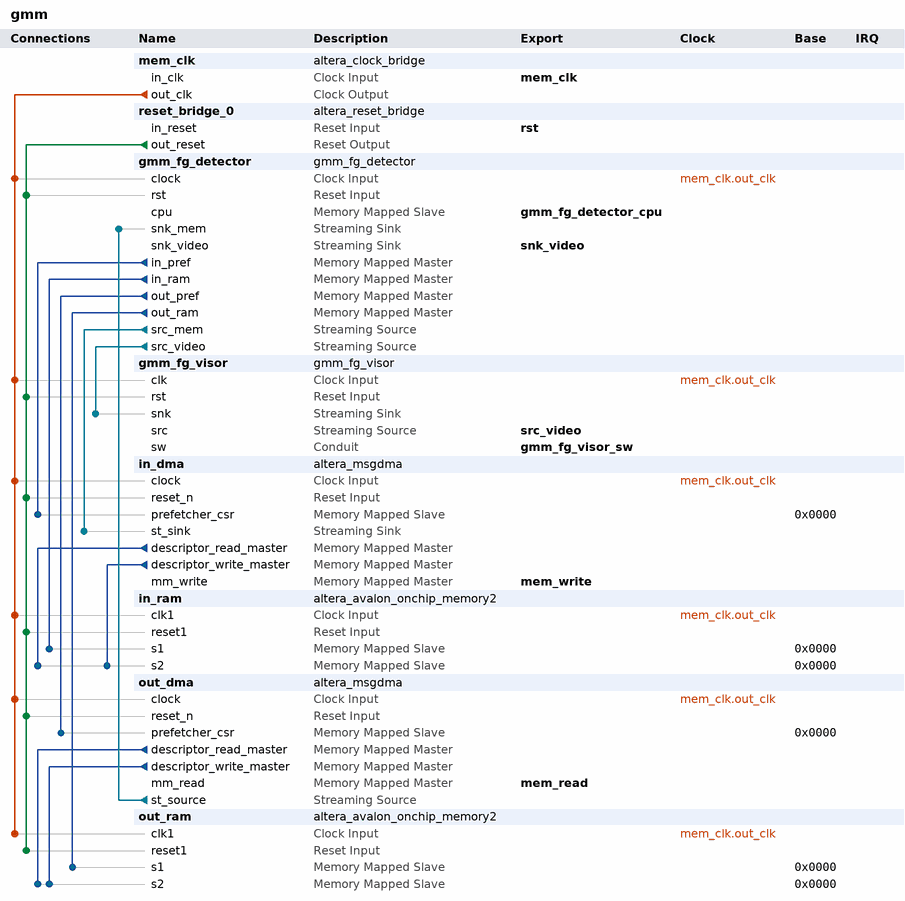
[diagram p0: system contents]
# Platform Designer (Qsys) system gmm, Cyclone V 5CSEBA6U23I7
# Parameters at their usual value, and those the tool derives, are not listed.
package require -exact qsys 18.1
create_system gmm
set_project_property DEVICE_FAMILY {Cyclone V}
set_project_property DEVICE 5CSEBA6U23I7

add_instance mem_clk altera_clock_bridge 18.1
set_instance_parameter_value mem_clk DERIVED_CLOCK_RATE 0
set_instance_parameter_value mem_clk EXPLICIT_CLOCK_RATE 0

add_instance reset_bridge_0 altera_reset_bridge 18.1
set_instance_parameter_value reset_bridge_0 ACTIVE_LOW_RESET 0
set_instance_parameter_value reset_bridge_0 SYNCHRONOUS_EDGES none

add_instance gmm_fg_detector gmm_fg_detector 1.13
set_instance_parameter_value gmm_fg_detector CONTROL_SPAN_BYTES 32
set_instance_parameter_value gmm_fg_detector FRAMES_NUM 2
set_instance_parameter_value gmm_fg_detector VIDEO_SPAN_BYTES 33177616
set_instance_parameter_value gmm_fg_detector VIDEO_START_ADDR 0

add_instance gmm_fg_visor gmm_fg_visor 1.0

add_instance in_dma altera_msgdma 18.1
set_instance_parameter_value in_dma BURST_ENABLE 1
set_instance_parameter_value in_dma DATA_FIFO_DEPTH 256
set_instance_parameter_value in_dma DATA_WIDTH 128
set_instance_parameter_value in_dma DESCRIPTOR_FIFO_DEPTH 16
set_instance_parameter_value in_dma ENHANCED_FEATURES 0
set_instance_parameter_value in_dma ERROR_ENABLE 0
set_instance_parameter_value in_dma MAX_BURST_COUNT 64
set_instance_parameter_value in_dma MAX_BYTE 1073741824
set_instance_parameter_value in_dma MODE 2
set_instance_parameter_value in_dma PACKET_ENABLE 1
set_instance_parameter_value in_dma PREFETCHER_ENABLE 1
set_instance_parameter_value in_dma TRANSFER_TYPE {Full Word Accesses Only}

add_instance in_ram altera_avalon_onchip_memory2 18.1
set_instance_parameter_value in_ram dataWidth 256
set_instance_parameter_value in_ram dualPort true
set_instance_parameter_value in_ram initMemContent false
set_instance_parameter_value in_ram initializationFileName onchip_mem.hex
set_instance_parameter_value in_ram memorySize 2048
set_instance_parameter_value in_ram singleClockOperation true

add_instance out_dma altera_msgdma 18.1
set_instance_parameter_value out_dma BURST_ENABLE 1
set_instance_parameter_value out_dma DATA_FIFO_DEPTH 256
set_instance_parameter_value out_dma DATA_WIDTH 128
set_instance_parameter_value out_dma DESCRIPTOR_FIFO_DEPTH 16
set_instance_parameter_value out_dma ENHANCED_FEATURES 0
set_instance_parameter_value out_dma ERROR_ENABLE 0
set_instance_parameter_value out_dma MAX_BURST_COUNT 64
set_instance_parameter_value out_dma MAX_BYTE 1073741824
set_instance_parameter_value out_dma MODE 1
set_instance_parameter_value out_dma PACKET_ENABLE 1
set_instance_parameter_value out_dma PREFETCHER_ENABLE 1
set_instance_parameter_value out_dma TRANSFER_TYPE {Full Word Accesses Only}

add_instance out_ram altera_avalon_onchip_memory2 18.1
set_instance_parameter_value out_ram dataWidth 256
set_instance_parameter_value out_ram dualPort true
set_instance_parameter_value out_ram initMemContent false
set_instance_parameter_value out_ram initializationFileName onchip_mem.hex
set_instance_parameter_value out_ram memorySize 2048
set_instance_parameter_value out_ram singleClockOperation true

# connections
add_connection mem_clk.out_clk gmm_fg_detector.clock clock
add_connection mem_clk.out_clk gmm_fg_visor.clk clock
add_connection mem_clk.out_clk in_dma.clock clock
add_connection mem_clk.out_clk in_ram.clk1 clock
add_connection mem_clk.out_clk out_dma.clock clock
add_connection mem_clk.out_clk out_ram.clk1 clock
add_connection reset_bridge_0.out_reset gmm_fg_detector.rst reset
add_connection reset_bridge_0.out_reset gmm_fg_visor.rst reset
add_connection reset_bridge_0.out_reset in_dma.reset_n reset
add_connection reset_bridge_0.out_reset in_ram.reset1 reset
add_connection reset_bridge_0.out_reset out_dma.reset_n reset
add_connection reset_bridge_0.out_reset out_ram.reset1 reset
add_connection gmm_fg_detector.in_pref in_dma.prefetcher_csr avalon
set_connection_parameter_value gmm_fg_detector.in_pref/in_dma.prefetcher_csr baseAddress 0x0000
add_connection gmm_fg_detector.in_ram in_ram.s1 avalon
set_connection_parameter_value gmm_fg_detector.in_ram/in_ram.s1 baseAddress 0x0000
add_connection gmm_fg_detector.out_pref out_dma.prefetcher_csr avalon
set_connection_parameter_value gmm_fg_detector.out_pref/out_dma.prefetcher_csr baseAddress 0x0000
add_connection gmm_fg_detector.out_ram out_ram.s1 avalon
set_connection_parameter_value gmm_fg_detector.out_ram/out_ram.s1 baseAddress 0x0000
add_connection in_dma.descriptor_read_master in_ram.s2 avalon
set_connection_parameter_value in_dma.descriptor_read_master/in_ram.s2 baseAddress 0x0000
add_connection in_dma.descriptor_write_master in_ram.s2 avalon
set_connection_parameter_value in_dma.descriptor_write_master/in_ram.s2 baseAddress 0x0000
add_connection out_dma.descriptor_read_master out_ram.s2 avalon
set_connection_parameter_value out_dma.descriptor_read_master/out_ram.s2 baseAddress 0x0000
add_connection out_dma.descriptor_write_master out_ram.s2 avalon
set_connection_parameter_value out_dma.descriptor_write_master/out_ram.s2 baseAddress 0x0000
add_connection gmm_fg_detector.src_mem in_dma.st_sink avalon_streaming
add_connection gmm_fg_detector.src_video gmm_fg_visor.snk avalon_streaming
add_connection out_dma.st_source gmm_fg_detector.snk_mem avalon_streaming

# exported interfaces
add_interface gmm_fg_detector_cpu avalon slave
set_interface_property gmm_fg_detector_cpu EXPORT_OF gmm_fg_detector.cpu
add_interface gmm_fg_visor_sw conduit end
set_interface_property gmm_fg_visor_sw EXPORT_OF gmm_fg_visor.sw
add_interface mem_clk clock sink
set_interface_property mem_clk EXPORT_OF mem_clk.in_clk
add_interface mem_read avalon master
set_interface_property mem_read EXPORT_OF out_dma.mm_read
add_interface mem_write avalon master
set_interface_property mem_write EXPORT_OF in_dma.mm_write
add_interface rst reset sink
set_interface_property rst EXPORT_OF reset_bridge_0.in_reset
add_interface snk_video avalon_streaming sink
set_interface_property snk_video EXPORT_OF gmm_fg_detector.snk_video
add_interface src_video avalon_streaming source
set_interface_property src_video EXPORT_OF gmm_fg_visor.src

set_interconnect_requirement {$system} qsys_mm.clockCrossingAdapter HANDSHAKE
set_interconnect_requirement {$system} qsys_mm.enableEccProtection FALSE
set_interconnect_requirement {$system} qsys_mm.insertDefaultSlave FALSE
set_interconnect_requirement {$system} qsys_mm.maxAdditionalLatency 1

save_system gmm.qsys
